# EasyEDA Pro project DevBoard_20240716.eprj

# Schematic Sheet2
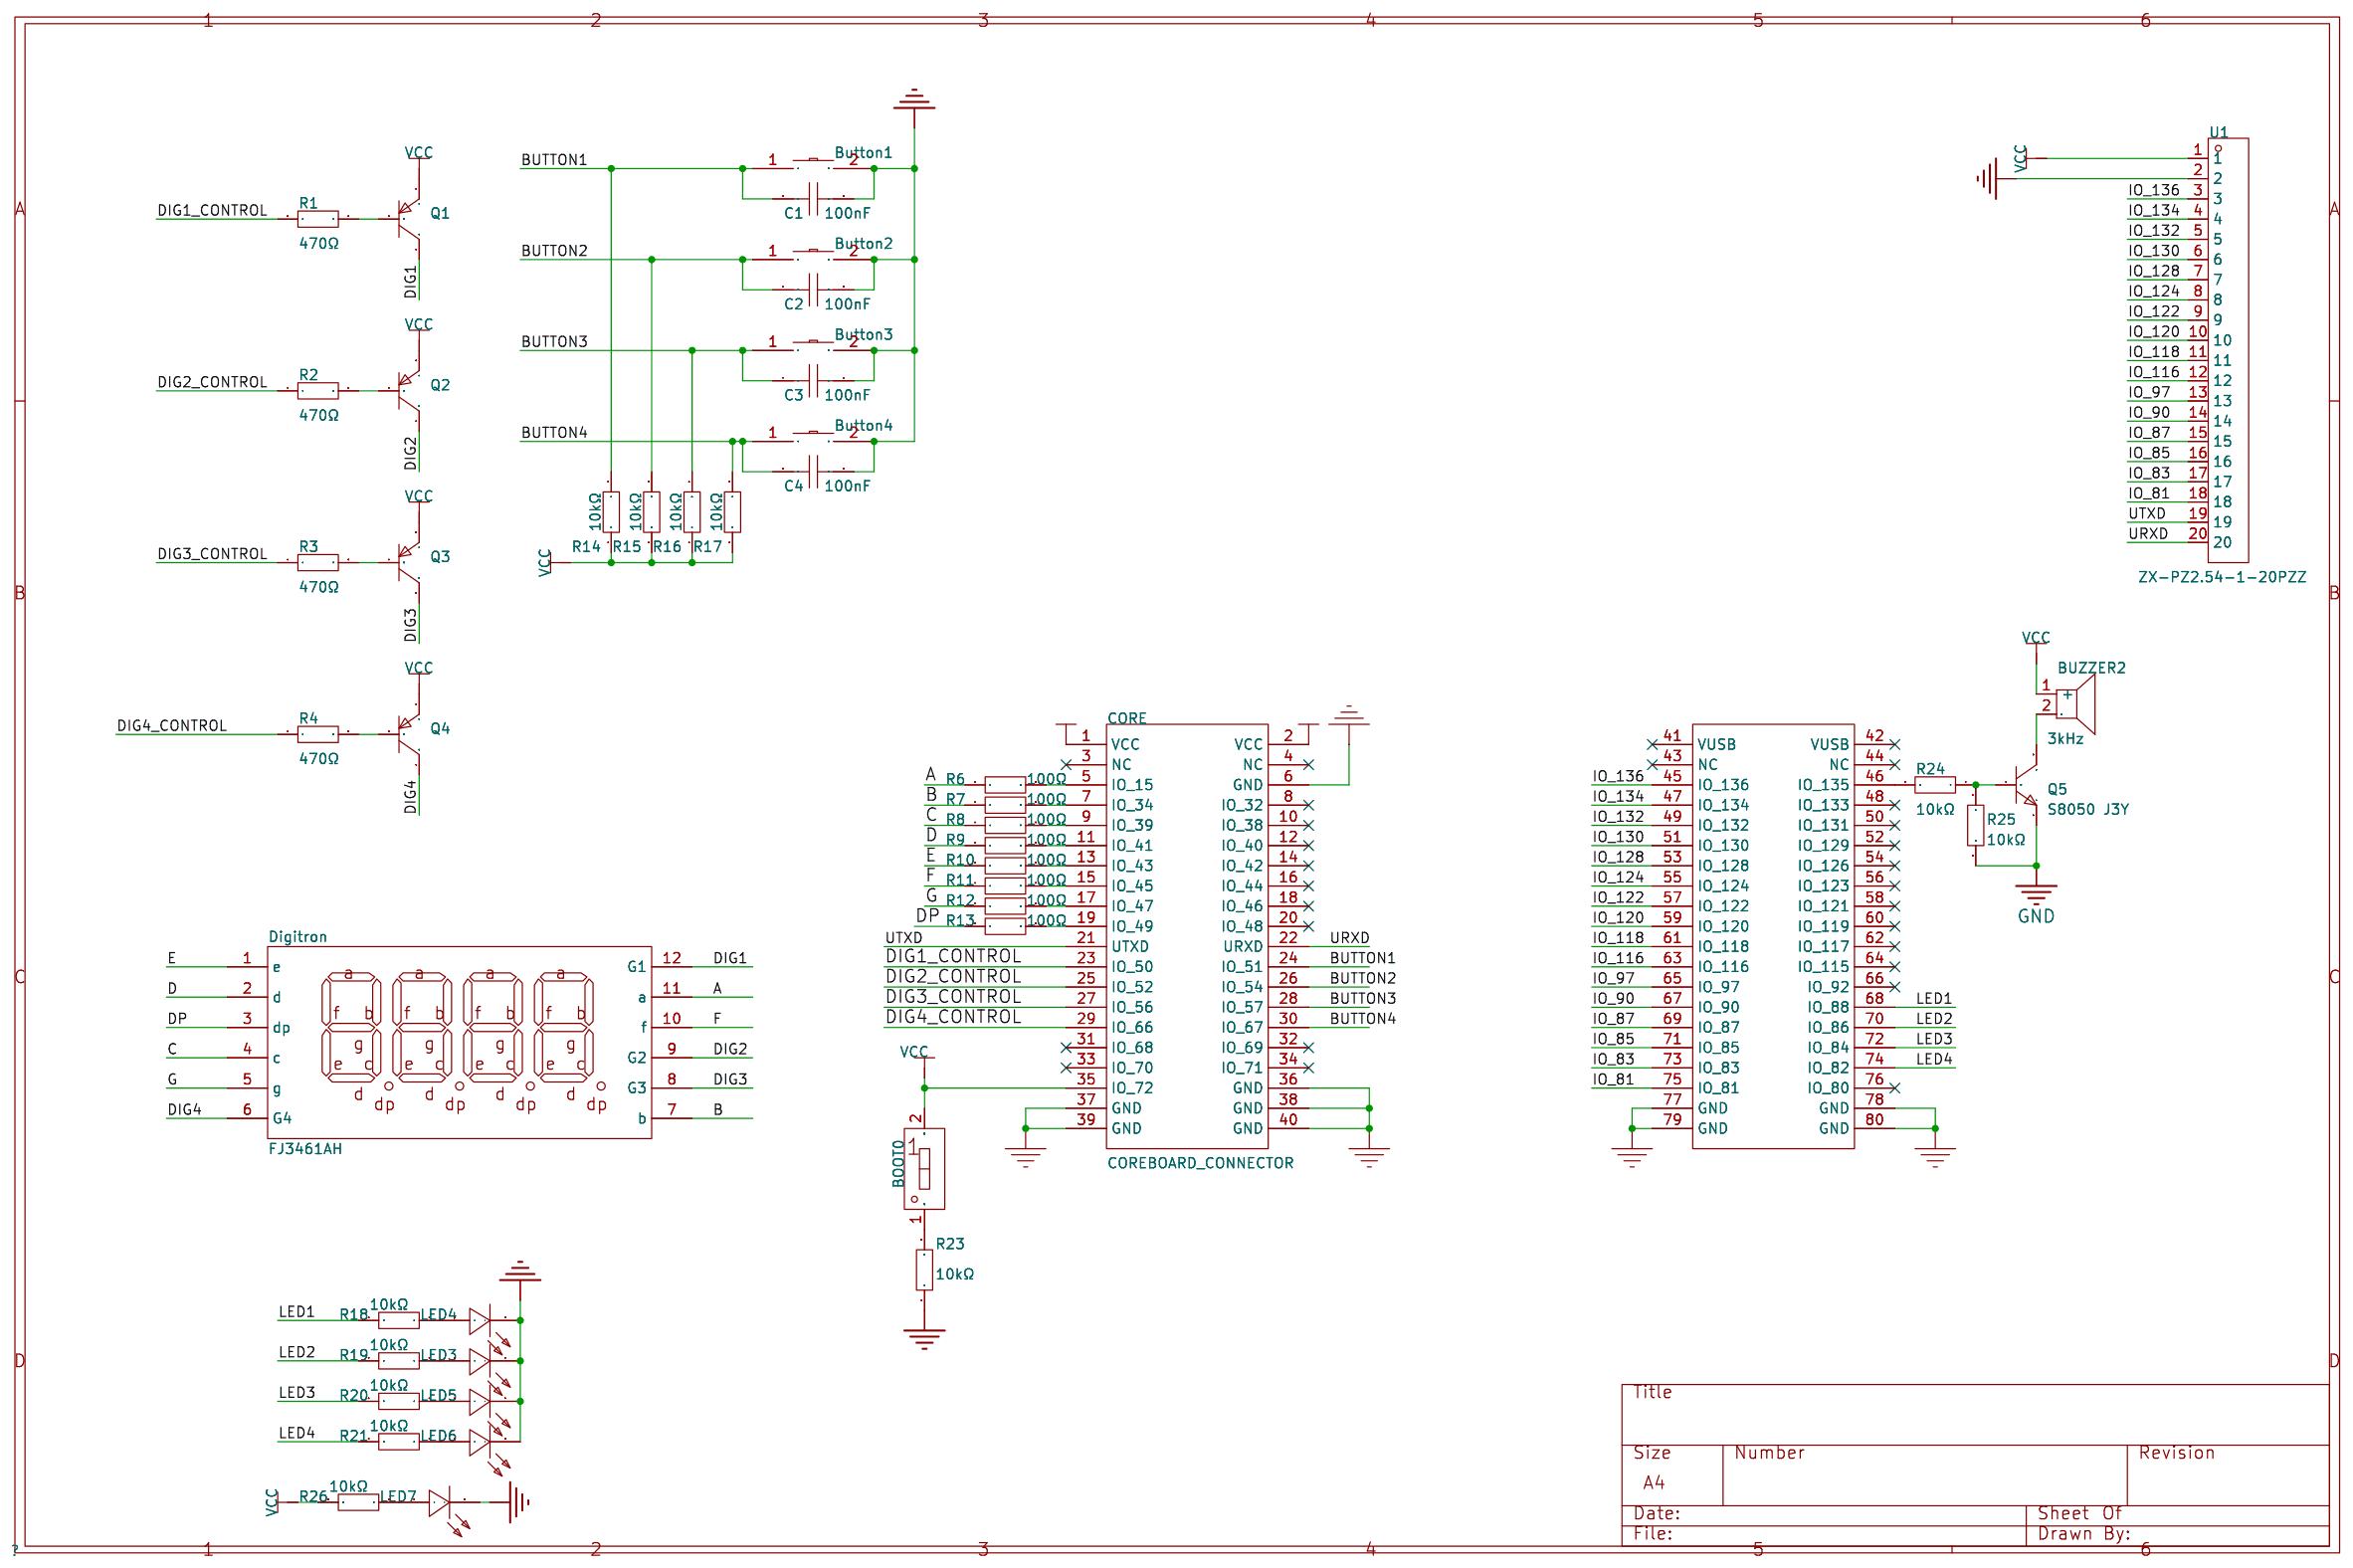
[diagram p0: schematic sheet]

## Parts
BOOT0  DSIC01LS-P  [SW-SMD_2P-L3.5-W6.2-P2.54-LS9.8]
Button1  TS-1101-C-W  [SW-SMD_L6.0-W3.3-LS8.0]
Button2  TS-1101-C-W  [SW-SMD_L6.0-W3.3-LS8.0]
Button3  TS-1101-C-W  [SW-SMD_L6.0-W3.3-LS8.0]
Button4  TS-1101-C-W  [SW-SMD_L6.0-W3.3-LS8.0]
BUZZER2  3kHz  [BUZ-TH_BD9.6-P5.00-D0.7-FD]
C1  100nF  [C0603]
C2  100nF  [C0603]
C3  100nF  [C0603]
C4  100nF  [C0603]
CORE  COREBOARD_CONNECTOR  [coreboard_connector]
Digitron  FJ3461AH  [LED-SEG-TH_12P-L30.0-W14.0-P2.54-S10.16-BL]
LED3  NCD0805B2  [LED0805-R-RD]
LED4  NCD0805B2  [LED0805-R-RD]
LED5  NCD0805B2  [LED0805-R-RD]
LED6  NCD0805B2  [LED0805-R-RD]
LED7  NCD0805B2  [LED0805-R-RD]
Q1  -  [S8550P_SOT]
Q2  -  [S8550P_SOT]
Q3  -  [S8550P_SOT]
Q4  -  [S8550P_SOT]
Q5  S8050 J3Y  [SOT-23-3_L3.0-W1.7-P0.95-LS2.9-BR]
R1  470Ω  [R0603]
R2  470Ω  [R0603]
R3  470Ω  [R0603]
R4  470Ω  [R0603]
R6  100Ω  [R0603]
R7  100Ω  [R0603]
R8  100Ω  [R0603]
R9  100Ω  [R0603]
R10  100Ω  [R0603]
R11  100Ω  [R0603]
R12  100Ω  [R0603]
R13  100Ω  [R0603]
R14  10kΩ  [R0603]
R15  10kΩ  [R0603]
R16  10kΩ  [R0603]
R17  10kΩ  [R0603]
R18  10kΩ  [R0603]
R19  10kΩ  [R0603]
R20  10kΩ  [R0603]
R21  10kΩ  [R0603]
R23  10kΩ  [R0603]
R24  10kΩ  [R0805]
R25  10kΩ  [R0805]
R26  10kΩ  [R0603]
U1  ZX-PZ2.54-1-20PZZ  [HDR-TH_20P-P2.54-V-M]

## Library data of the parts
BOOT0 = DSIC01LS-P: 类型:平拨,凸起式;电路结构:单刀单掷;开关位数:1位;额定电流:25mA;额定电压:24V;使用寿命:3千次;颜色:黑色;; LCSC Part Name: 平拨,凸起式 1位拨码开关; Supplier Part: C600988; Manufacturer: XKB Connectivity(中国星坤); Supplier Footprint: SMD,3.5x6.2mm; JLCPCB Part Class: 扩展库; Datasheet: https://atta.szlcsc.com/upload/public/pdf/source/20181029/C319044_89B44386426E378AA9595AB22F0589AA.pdf; Supplier: LCSC; Type: 平拨,凸起式; Circuit: 单刀单掷; Number of Positions: 1位; Pin Style: 鸥翼型; Current Rating: 25mA; Voltage Rating: 24V; Operating Temperature: -20℃~+70℃; Operating Life: 3千次; Color: 黑色
Button1-Button4 = TS-1101-C-W: 电路结构:单刀单掷;按钮形状:矩形按钮;作用力:260gf;安装方式:立贴;开关长度:6mm;开关宽度:3.6mm;开关高度:2.5mm;带支架:不带;触点电流:50mA;额定电压(AC):-;额定电压(DC):12V;额定功率:-;绝缘电阻:-;带灯:无;机械寿命:5万次;; LCSC Part Name: 6*3.6*2.5mm 立贴 轻触开关; Supplier Part: C318938; Manufacturer: XKB Connectivity(中国星坤); Supplier Footprint: SMD; JLCPCB Part Class: 扩展库; Datasheet: https://atta.szlcsc.com/upload/public/pdf/source/20200227/C318938_C2E53B1EEDE37D980A33616AC086DE53.pdf; Supplier: LCSC; Circuit: 单刀单掷; Actuator Style: 矩形按钮; Operating Force: 260gf; Mounting Style: 立贴; Switch Length: 6mm; Switch Width: 3.6mm; Switch Height: 2.5mm; Strike Gundam: 不带; Contact Current: 50mA; Voltage Rating (DC): 12V; Actuator/Cap Color: 白色带淡绿; With Lamp: 无; Mechanical Life: 5万次; Operating Temperature: -30℃~+85℃
BUZZER2 = HNB09A05: 驱动方式:有源(内含驱动线路);构造类型:电磁式;频率:3kHz;声压(SPL):85dB;; Supplier Part: C96493; Manufacturer: 华能; Supplier Footprint: 插件,D=9mm; JLCPCB Part Class: 扩展库; Datasheet: https://atta.szlcsc.com/upload/public/pdf/source/20170522/1495448327549.pdf; Supplier: LCSC; Oscillator Circuit: 有源(内含驱动线路); Technology Type: 电磁式; Operating Voltage: 4V~8V; Sound Pressure Level (SPL): 85dB; Diameter (φD): 9mm; Height: 5.7mm
C1-C4 = CC0603KRX7R9BB104: 容值:100nF;精度:±10%;额定电压:50V;材质(温度系数):X7R;; LCSC Part Name: 100nF ±10% 50V; Supplier Part: C14663; Manufacturer: YAGEO(国巨); Supplier Footprint: 0603; JLCPCB Part Class: 基础库; Datasheet: https://atta.szlcsc.com/upload/public/pdf/source/20180910/C282072_33301C7F631E79921B82A8DAC6BCC5B3.pdf; Supplier: LCSC; Tolerance: ±10%; Voltage Rated: 50V; Temperature Coefficient: X7R
CORE = COREBOARD_CONNECTOR: Library Name: 原理图库
Digitron = FJ3461AH: 数码管位数:4位;功耗:-;发光颜色:红色;LED极性:共阴极;数字/字母大小(英寸):0.36;; LCSC Part Name: 4位0.36英寸红色数码管 共阴极; Supplier Part: C10708; Manufacturer: 志浩; Supplier Footprint: 插件; JLCPCB Part Class: 扩展库; Datasheet: https://atta.szlcsc.com/upload/public/pdf/source/20121231/1457706574766.pdf; Supplier: LCSC; Number of Characters: 4位; Module Size: 30mmx14mmx7.2mm; Luminous Color: 红色; LED Polarity: 共阴极; Digit/Alpha Size(inch): 0.36
LED3-LED7 = NCD0805B2: 发光颜色:蓝色;正向电压(VF):2.5V~3.6V;功率:72mW;正向电流:2mA;主波长:468nm~478nm;透镜颜色:无色透明透镜;发光强度:20mcd~55mcd;发光角度:130°;工作温度:-30℃~+85℃;; Supplier Part: C84259; Manufacturer: 国星光电; Supplier Footprint: 0805; JLCPCB Part Class: 扩展库; Datasheet: https://atta.szlcsc.com/upload/public/pdf/source/20200820/C84259_E5AC6865415989C4C2C2831134BA3A23.pdf; Supplier: LCSC; Emitted Color: 蓝色; Forward Voltage (VF): 2.5V~3.6V; Power Dissipation: 72mW; Forward Current: 2mA; Dominant Wavelength: 468nm~478nm; Lens Color: 无色透明透镜; Luminous Intensity: 20mcd~55mcd; Viewing Angle: 130°; Operating Temperature: -30℃~+85℃
Q1-Q4 = S8550_SOT_PNP: Supplier Footprint: SOT-23
Q5 = S8050 J3Y_C2146: 晶体管类型:NPN;集射极击穿电压(Vceo):25V;集电极电流(Ic):500mA;功率(Pd):300mW;直流电流增益(hFE@Ic,Vce):200@50mA,1V;; LCSC Part Name: NPN 25V 500mA (200-350); Supplier Part: C2146; Manufacturer: CJ(江苏长电/长晶); Supplier Footprint: SOT-23; Datasheet: https://atta.szlcsc.com/upload/public/pdf/source/20140809/1457707209234.pdf; Supplier: LCSC; Transistor Type: NPN; Collector-Emitter Breakdown Voltage (Vceo): 25V; Collector Current (Ic): 500mA; Power Dissipation (Pd): 300mW; Collector Cut-Off Current (Icbo): 100nA; Collector-Emitter Saturation Voltage (VCE(sat)@Ic,Ib): 600mV@500mA,50mA; DC Current Gain (hFE@Ic,Vce): 200@50mA,1V; Transition Frequency (fT): 150MHz; Operating Temperature: +150℃@(Tj)
R1-R4 = 0603WAF4700T5E: 电阻类型:厚膜电阻;阻值:470Ω;精度:±1%;功率:100mW;最大工作电压:75V;温度系数:±100ppm/℃;; LCSC Part Name: 470Ω ±1% 100mW 厚膜电阻; Supplier Part: C23179; Manufacturer: UNI-ROYAL(厚声); Supplier Footprint: 0603; JLCPCB Part Class: 基础库; Datasheet: https://atta.szlcsc.com/upload/public/pdf/source/20200306/C422600_1E6D84923E4A46A82E41ADD87F860B5C.pdf; Supplier: LCSC; Type: 厚膜电阻; Tolerance: ±1%; Power(Watts): 100mW; Overload Voltage (Max): 75V; Temperature Coefficient: ±100ppm/℃; Operating Temperature Range: -55℃~+155℃
R6-R13 = 0603WAF1000T5E: 电阻类型:厚膜电阻;阻值:100Ω;精度:±1%;功率:100mW;最大工作电压:75V;温度系数:±200ppm/℃;; LCSC Part Name: 100Ω ±1% 100mW 厚膜电阻; Supplier Part: C22775; Manufacturer: UNI-ROYAL(厚声); Supplier Footprint: 0603; JLCPCB Part Class: 基础库; Datasheet: https://atta.szlcsc.com/upload/public/pdf/source/20200306/C422600_1E6D84923E4A46A82E41ADD87F860B5C.pdf; Supplier: LCSC; Type: 厚膜电阻; Tolerance: ±1%; Power(Watts): 100mW; Overload Voltage (Max): 75V; Temperature Coefficient: ±200ppm/℃; Operating Temperature Range: -55℃~+155℃
R14-R21 R23 R26 = 0603WAF1002T5E: 电阻类型:厚膜电阻;阻值:10kΩ;精度:±1%;功率:100mW;最大工作电压:75V;温度系数:±100ppm/℃;; LCSC Part Name: 厚膜电阻 10kΩ ±1% 100mW; Supplier Part: C25804; Manufacturer: UNI-ROYAL(厚声); Supplier Footprint: 0603; JLCPCB Part Class: 基础库; Datasheet: https://atta.szlcsc.com/upload/public/pdf/source/20200306/C422600_1E6D84923E4A46A82E41ADD87F860B5C.pdf; Supplier: LCSC; Type: 厚膜电阻; Tolerance: ±1%; Power(Watts): 100mW; Overload Voltage (Max): 75V; Temperature Coefficient: ±100ppm/℃; Operating Temperature Range: -55℃~+155℃
R24 R25 = 0805W8F1002T5E_C17414: 阻值:10kΩ;精度:±1%;功率:125mW;温度系数:±100ppm/℃;电阻类型:厚膜电阻;; LCSC Part Name: 10kΩ ±1% 125mW 厚膜电阻; Supplier Part: C17414; Manufacturer: UNI-ROYAL(厚声); Manufacturer Part: 0805W8F1002T5E; Supplier Footprint: 0805; Datasheet: https://atta.szlcsc.com/upload/public/pdf/source/20200306/C422600_1E6D84923E4A46A82E41ADD87F860B5C.pdf; Supplier: LCSC; Tolerance: ±1%; Power(Watts): 125mW; Overload Voltage (Max): 150V; Temperature Coefficient: ±100ppm/℃; Type: 厚膜电阻; Operating Temperature Range: -55℃~+155℃
U1 = ZX-PZ2.54-1-20PZZ: 插针结构:1x20P;间距:2.54mm;行距:-;圆针/方针:方针;安装类型:直插;排数:单排;总PIN位数:20P;额定电流:3A;额定电压:1kV;配合针长度:6mm;塑高:2.5mm;端接针长度:3mm;触头材质:黄铜;触头镀层:金;工作温度范围:-40℃~+105℃;焊接温度(最大值):-;颜色:黑色;; LCSC Part Name: 1x20P 间距:2.54mm 方针 直插; Supplier Part: C7501271; Manufacturer: Megastar(兆星); Supplier Footprint: 插件,P=2.54mm; JLCPCB Part Class: 扩展库; Datasheet: https://atta.szlcsc.com/upload/public/pdf/source/20231122/B067D1B32B7C78CBB999092E986F6F61.pdf; Supplier: LCSC; Pin Structure: 1x20P; Pitch: 2.54mm; Circluar Pins/Square Pins: 方针; Mounting Type: 直插; Number of Rows: 单排; Number of Pins: 20P; Current Rating (Max): 3A; Voltage Rating (Max): 1kV; Length of Mating Pin: 6mm; Insulation Height: 2.5mm; Length of End Connection Pin: 3mm; Contact Material: 黄铜; Contact Plating: 金; Operating Temperature Range: -40℃~+105℃; Color: 黑色

## Nets
GND: Button1.2 Button2.2 Button3.2 Button4.2 C1.2 C2.2 C3.2 C4.2 CORE.6(GND) CORE.36(GND) CORE.37(GND) CORE.38(GND) CORE.39(GND) CORE.40(GND) CORE.77(GND) CORE.78(GND) CORE.79(GND) CORE.80(GND) LED3.2(-) LED4.2(-) LED5.2(-) LED6.2(-) LED7.2(-) Q5.2(E) R23.1 R25.2 U1.2
VCC: BOOT0.2(PIN2) BUZZER2.1(+) CORE.1(VCC) CORE.2(VCC) CORE.35(IO_72) Q1.2(E) Q2.2(E) Q3.2(E) Q4.2(E) R14.1 R15.1 R16.1 R17.1 R26.2 U1.1
A: Digitron.11(a) R6.1
B: Digitron.7(b) R7.1
BUTTON1: Button1.1 C1.1 CORE.24(IO_51) R14.2
BUTTON2: Button2.1 C2.1 CORE.26(IO_54) R15.2
BUTTON3: Button3.1 C3.1 CORE.28(IO_57) R16.2
BUTTON4: Button4.1 C4.1 CORE.30(IO_67) R17.2
C: Digitron.4(c) R8.1
D: Digitron.2(d) R9.1
DIG1: Digitron.12(G1) Q1.3(C)
DIG1_CONTROL: CORE.23(IO_50) R1.2
DIG2: Digitron.9(G2) Q2.3(C)
DIG2_CONTROL: CORE.25(IO_52) R2.1
DIG3: Digitron.8(G3) Q3.3(C)
DIG3_CONTROL: CORE.27(IO_56) R3.1
DIG4: Digitron.6(G4) Q4.3(C)
DIG4_CONTROL: CORE.29(IO_66) R4.1
DP: Digitron.3(dp) R13.1
E: Digitron.1(e) R10.1
F: Digitron.10(f) R11.1
G: Digitron.5(g) R12.1
IO_81: CORE.75(IO_81) U1.18
IO_83: CORE.73(IO_83) U1.17
IO_85: CORE.71(IO_85) U1.16
IO_87: CORE.69(IO_87) U1.15
IO_90: CORE.67(IO_90) U1.14
IO_97: CORE.65(IO_97) U1.13
IO_116: CORE.63(IO_116) U1.12
IO_118: CORE.61(IO_118) U1.11
IO_120: CORE.59(IO_120) U1.10
IO_122: CORE.57(IO_122) U1.9
IO_124: CORE.55(IO_124) U1.8
IO_128: CORE.53(IO_128) U1.7
IO_130: CORE.51(IO_130) U1.6
IO_132: CORE.49(IO_132) U1.5
IO_134: CORE.47(IO_134) U1.4
IO_136: CORE.45(IO_136) U1.3
LED1: CORE.68(IO_88) R18.2
LED2: CORE.70(IO_86) R19.2
LED3: CORE.72(IO_84) R20.2
LED4: CORE.74(IO_82) R21.2
URXD: CORE.22(URXD) U1.20
UTXD: CORE.21(UTXD) U1.19
$1N2952: Q1.1(B) R1.1
$1N2997: Q2.1(B) R2.2
$1N3042: Q3.1(B) R3.2
$1N3087: Q4.1(B) R4.2
$1N3645: CORE.5(IO_15) R6.2
$1N3690: CORE.7(IO_34) R7.2
$1N3862: CORE.9(IO_39) R8.2
$1N3907: CORE.11(IO_41) R9.2
$1N3952: CORE.13(IO_43) R10.2
$1N3997: CORE.15(IO_45) R11.2
$1N4042: CORE.17(IO_47) R12.2
$1N4087: CORE.19(IO_49) R13.2
$1N6621: Q5.1(B) R24.1 R25.1
$1N6767: CORE.46(IO_135) R24.2
Net-(BOOT0-1): BOOT0.1(PIN1) R23.2
Net-(BUZZER2-2): BUZZER2.2 Q5.3(C)
Net-(LED3-1): LED3.1(+) R19.1
Net-(LED4-1): LED4.1(+) R18.1
Net-(LED5-1): LED5.1(+) R20.1
Net-(LED6-1): LED6.1(+) R21.1
Net-(LED7-1): LED7.1(+) R26.1

Not connected (* = marked no-connect by the designer): CORE 3(NC)* 4(NC)* 8(IO_32)* 10(IO_38)* 12(IO_40)* 14(IO_42)* 16(IO_44)* 18(IO_46)* 20(IO_48)* 31(IO_68)* 32(IO_69)* 33(IO_70)* 34(IO_71)* 41(VUSB)* 42(VUSB)* 43(NC)* 44(NC)* 48(IO_133)* 50(IO_131)* 52(IO_129)* 54(IO_126)* 56(IO_123)* 58(IO_121)* 60(IO_119)* 62(IO_117)* 64(IO_115)* 66(IO_92)* 76(IO_80)*

# Board PCB2
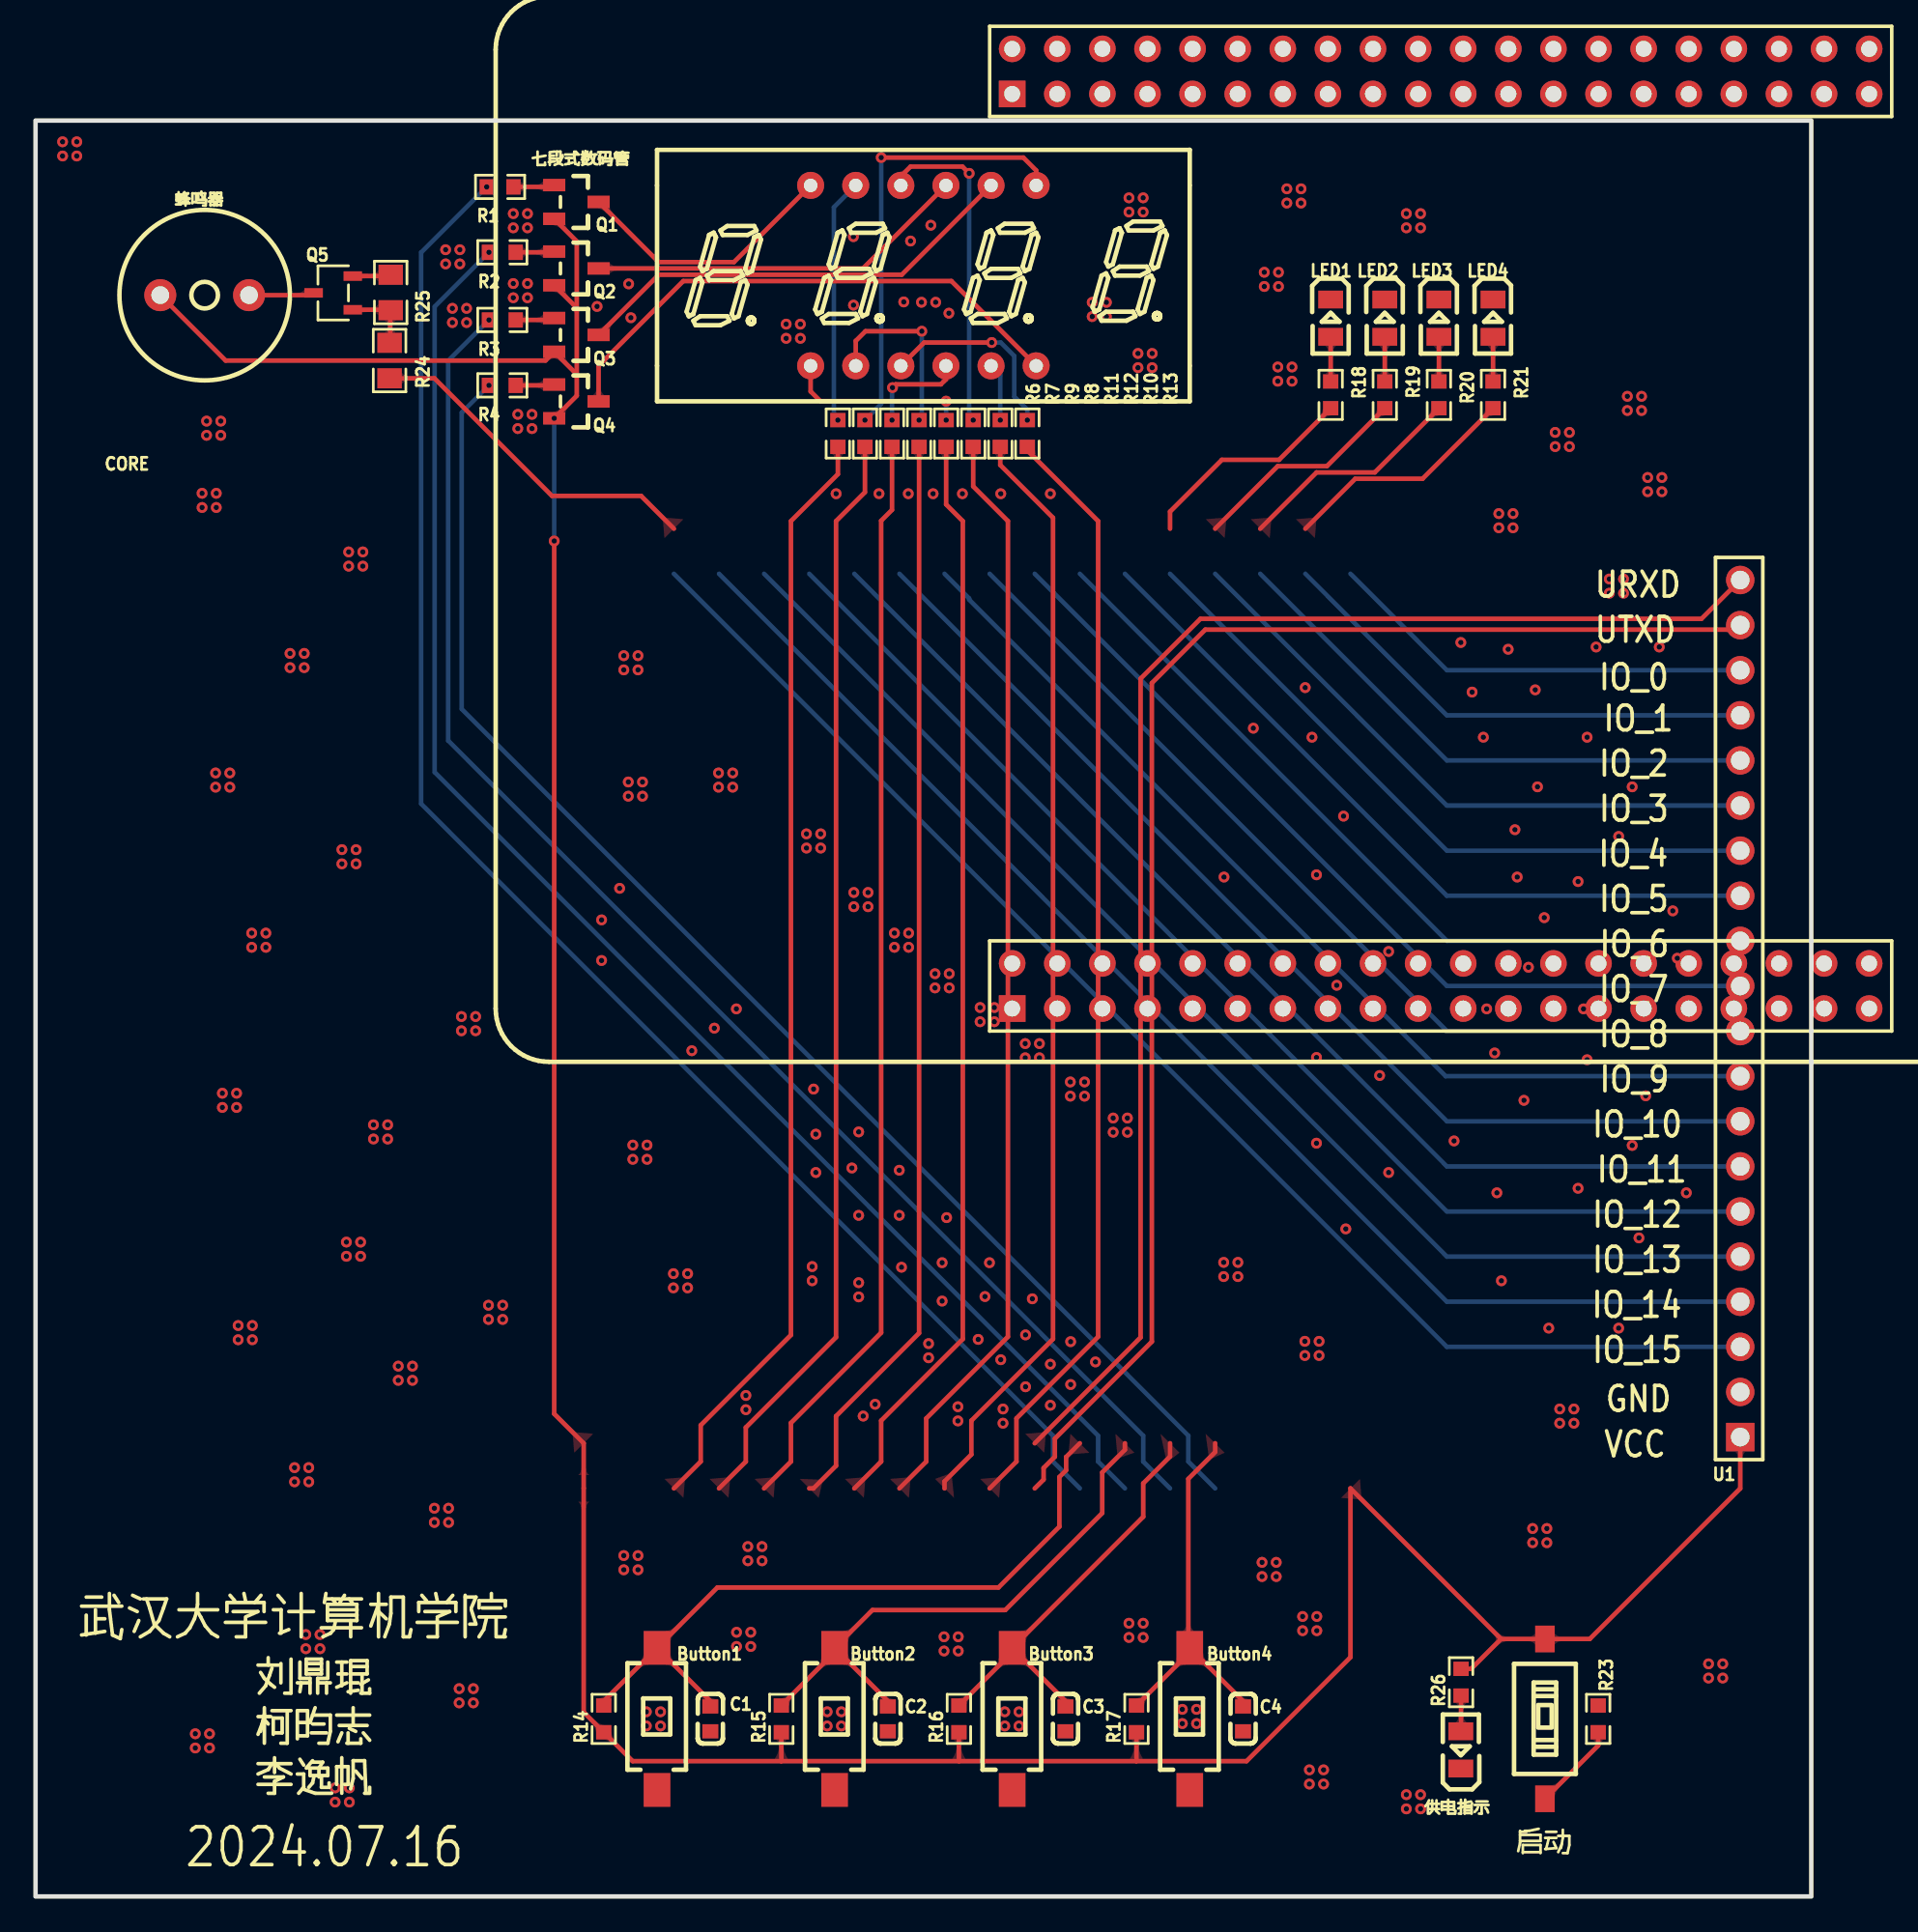
[diagram p1: board, top side]
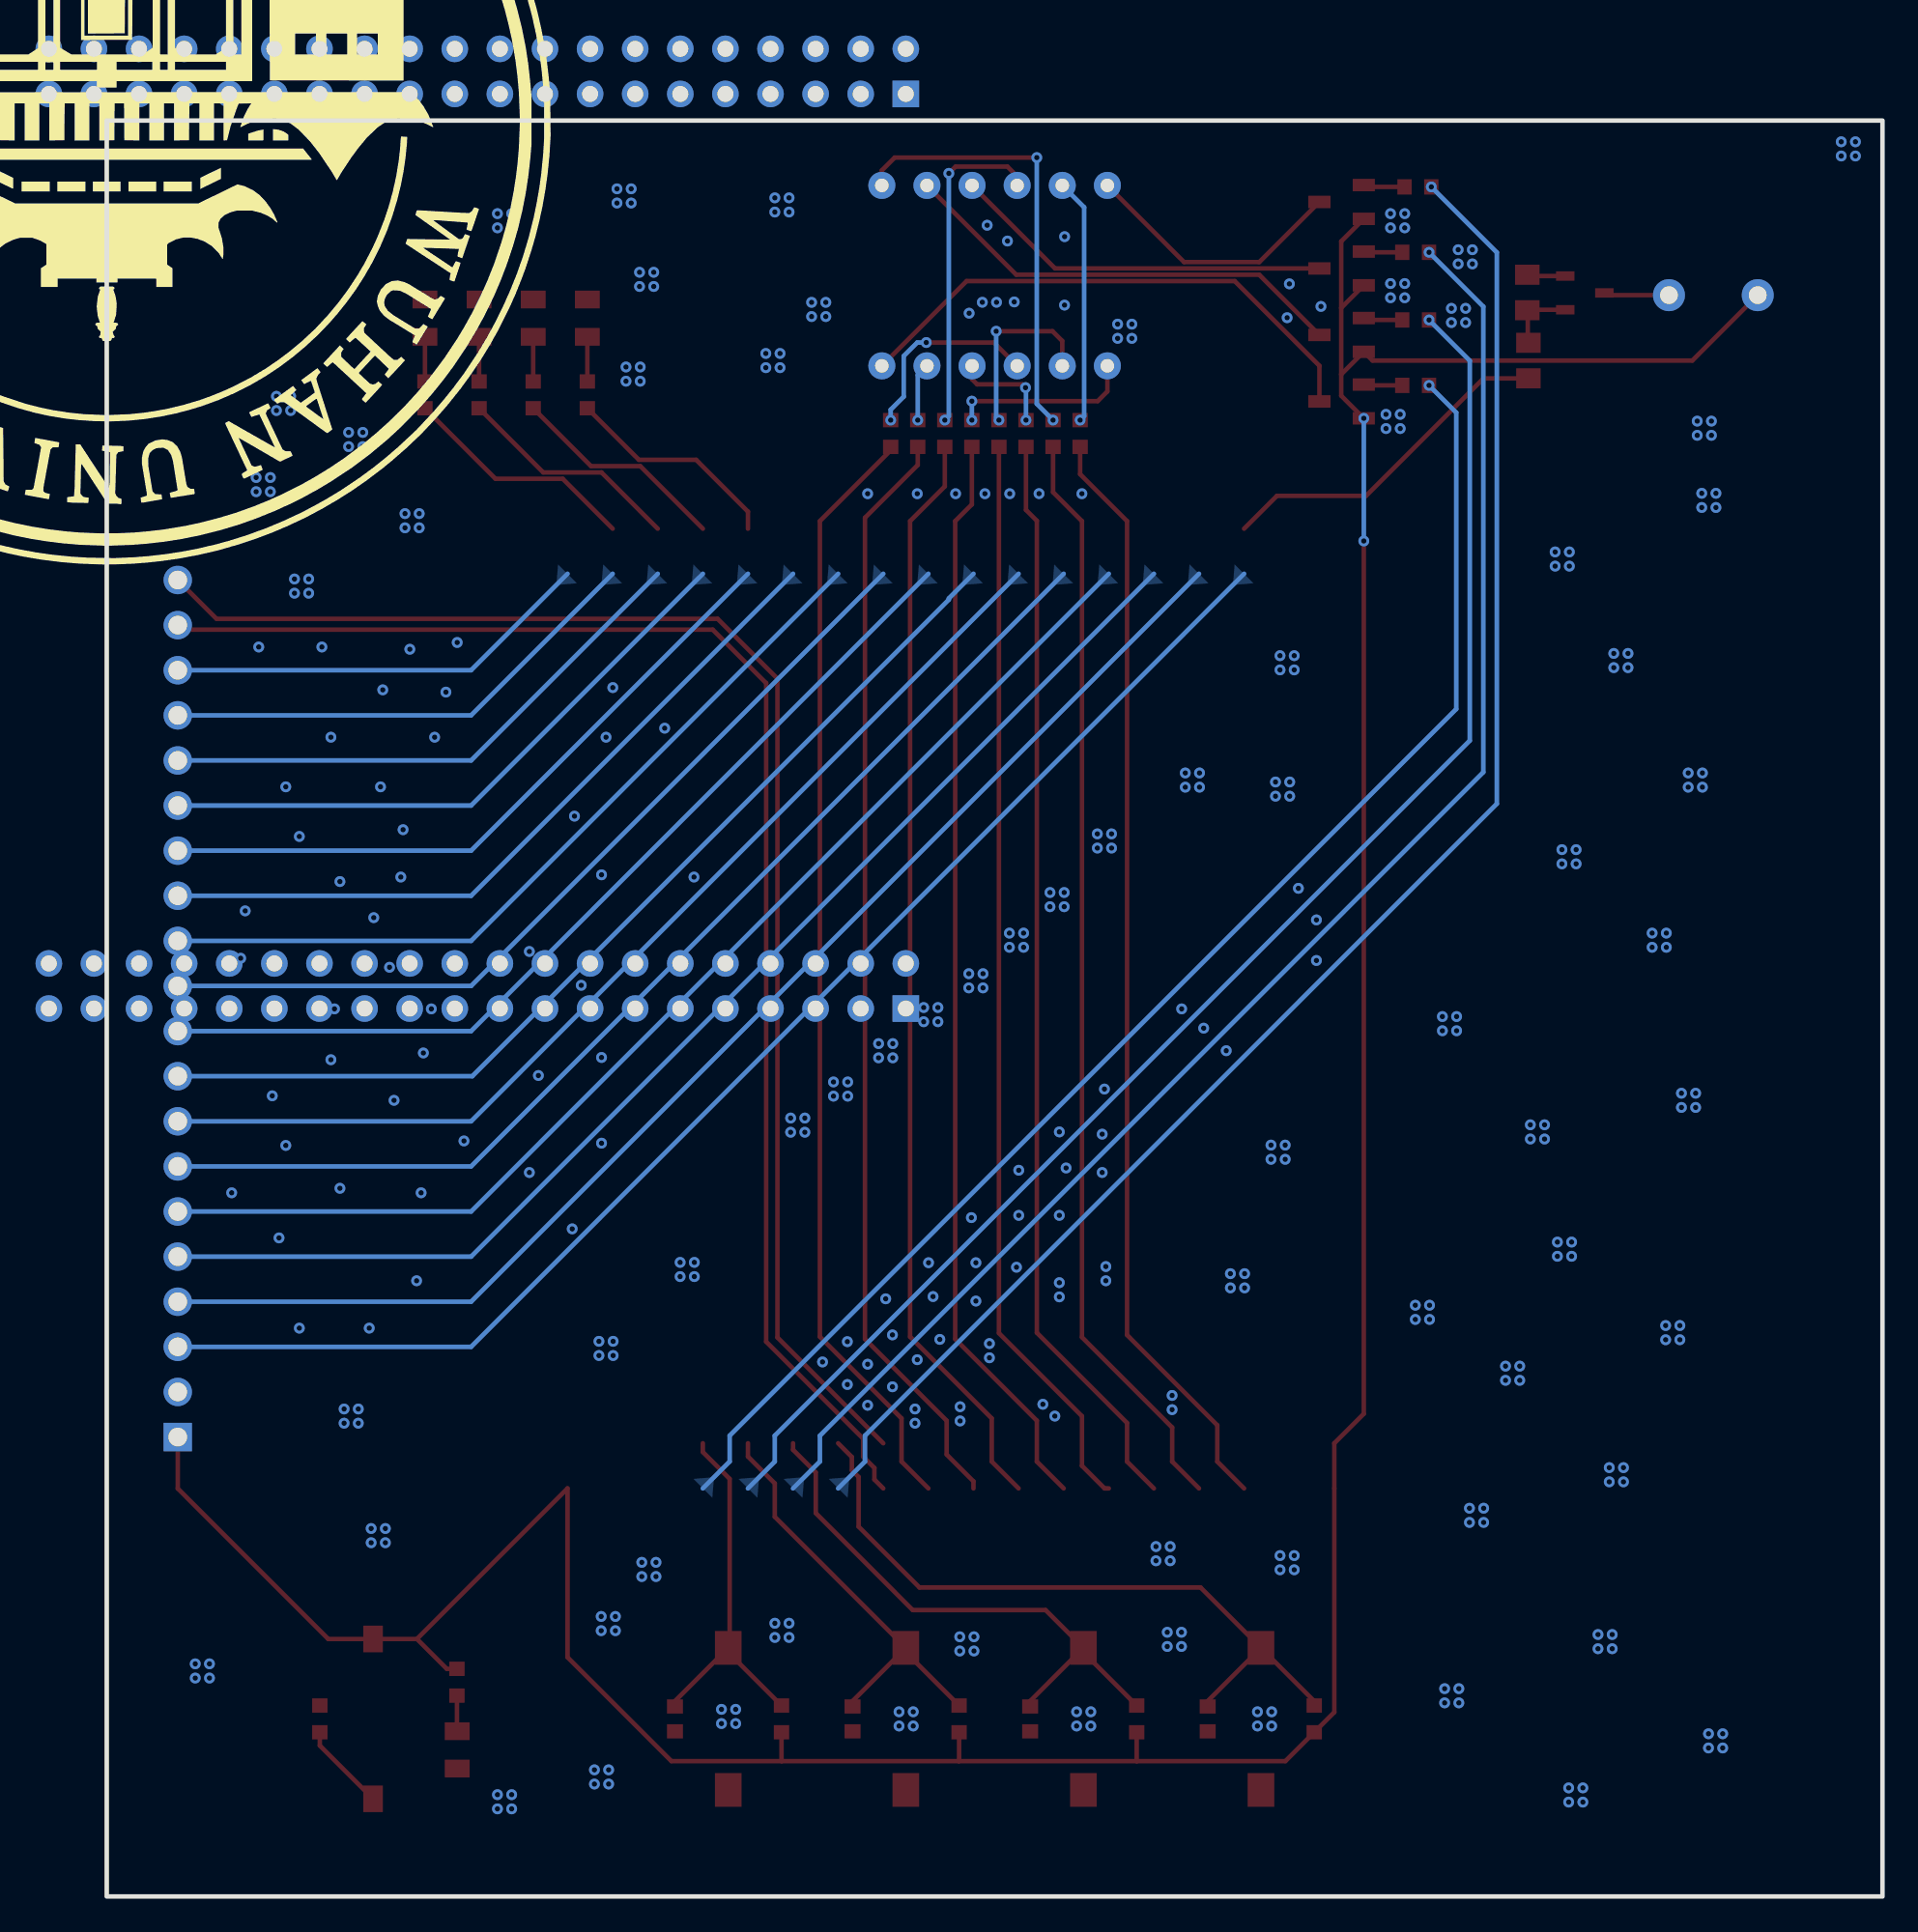
[diagram p2: board, bottom side, seen from below]

Outline 100 x 100 mm; copper layers: Top Layer, Bottom Layer. Coordinates in mm from the lower left corner of the outline.
Outline path: rectangle 0,100 100,0
Stack: Top Layer 0.035mm / Dielectric1 1.51mm FR4 er 4.5 / Bottom Layer 0.035mm

## Design rules (mm)
template: 自定义配置
spacing copperThickness1oz (default): track to track 0.102, other pairs 0.152 to 0.3
spacing copperThickness2oz: track to track 0.203, other pairs 0.152 to 0.3
track width copperThickness1oz (default): min 0.254, default 0.305, max 2.54
track width copperThickness2oz: min 0.203, default 0.254, max 2.54
differential pair differentialPair (default): width min 0.127, default 0.254, max 2.54; gap min 0.152, default 0.152
via viaSize (default): diameter min 0.5, default 0.61, max 10; hole min 0.3, default 0.305, max 6.299

## Placement (name value [footprint] x y rotation side)
Button1  TS-1101-C-W  [SW-SMD_L6.0-W3.3-LS8.0]  35 10 270 top
Button2  TS-1101-C-W  [SW-SMD_L6.0-W3.3-LS8.0]  45 10 270 top
Button3  TS-1101-C-W  [SW-SMD_L6.0-W3.3-LS8.0]  55 10 270 top
Button4  TS-1101-C-W  [SW-SMD_L6.0-W3.3-LS8.0]  65 10 270 top
C1  100nF  [C0603]  38 10 270 top
C2  100nF  [C0603]  48 10 270 top
C3  100nF  [C0603]  58 10 270 top
C4  100nF  [C0603]  68 10 270 top
CORE  COREBOARD_CONNECTOR  [coreboard_connector]  55 50 0 top
LED1  NCD0805B2  [LED0805-R-RD]  72.94 88.87 270 top
LED2  NCD0805B2  [LED0805-R-RD]  75.98 88.87 270 top
LED3  NCD0805B2  [LED0805-R-RD]  79.03 88.87 270 top
LED4  NCD0805B2  [LED0805-R-RD]  82.08 88.87 270 top
Q1  -  [S8550P_SOT]  30.5 95.42 180 top
Q2  -  [S8550P_SOT]  30.5 91.67 180 top
Q3  -  [S8550P_SOT]  30.5 87.93 180 top
Q4  -  [S8550P_SOT]  30.5 84.19 180 top
Q5  S8050 J3Y  [SOT-23-3_L3.0-W1.7-P0.95-LS2.9-BR]  16.76 90.3 0 top
R1  470Ω  [R0603]  26.16 96.27 180 top
R2  470Ω  [R0603]  26.29 92.58 0 top
R3  470Ω  [R0603]  26.29 88.77 0 top
R4  470Ω  [R0603]  26.29 85.09 0 top
R6  100Ω  [R0603]  45.18 82.38 270 top
R7  100Ω  [R0603]  46.71 82.38 270 top
R8  100Ω  [R0603]  48.23 82.38 270 top
R9  100Ω  [R0603]  49.76 82.38 270 top
R10  100Ω  [R0603]  51.28 82.38 270 top
R11  100Ω  [R0603]  52.8 82.38 270 top
R12  100Ω  [R0603]  54.33 82.38 270 top
R13  100Ω  [R0603]  55.85 82.38 270 top
R14  10kΩ  [R0603]  32 10 90 top
R15  10kΩ  [R0603]  42 10 90 top
R16  10kΩ  [R0603]  52 10 90 top
R17  10kΩ  [R0603]  62 10 90 top
R18  10kΩ  [R0603]  72.94 84.56 270 top
R19  10kΩ  [R0603]  75.98 84.56 270 top
R20  10kΩ  [R0603]  79.03 84.56 270 top
R21  10kΩ  [R0603]  82.08 84.56 270 top
R23  10kΩ  [R0603]  88 10 270 top
R24  10kΩ  [R0805]  19.94 86.49 270 top
R25  10kΩ  [R0805]  20 90.32 90 top
R26  10kΩ  [R0603]  80.28 12.06 90 top
U1  ZX-PZ2.54-1-20PZZ  [HDR-TH_20P-P2.54-V-M]  96 50 90 top
七段式数码管  FJ3461AH  [LED-SEG-TH_12P-L30.0-W14.0-P2.54-S10.16-BL]  50 91.27 0 top
供电指示  NCD0805B2  [LED0805-R-RD]  80.26 8.25 90 top
启动  DSIC01LS-P  [SW-SMD_2P-L3.5-W6.2-P2.54-LS9.8]  85 10 90 top
蜂鸣器  3kHz  [BUZ-TH_BD9.6-P5.00-D0.7-FD]  9.53 90.17 0 top

## Footprints (pads in the part's own frame, mm; a bottom-side part is the same pattern mirrored in y, then rotated)
BUZ-TH_BD9.6-P5.00-D0.7-FD
  round 1.8 hole 1: 1(-2.5,0) 2(2.5,0)
C0603
  rect 0.8x0.9 smd: 1(-0.7,0) 2(0.7,0)
coreboard_connector
  rect 1.5x1.5 hole 0.9: 1(0,0) 41(0,51.5)
  round 1.5 hole 0.9: 2(0,2.54) 3(2.54,0) 4(2.54,2.54) 5(5.08,0) 6(5.08,2.54) 7(7.62,0) 8(7.62,2.54) 9(10.16,0) 10(10.16,2.54) 11(12.7,0) 12(12.7,2.54) 13(15.24,0) 14(15.24,2.54) 15(17.78,0) 16(17.78,2.54) 17(20.32,0) 18(20.32,2.54) 19(22.86,0) 20(22.86,2.54) 21(25.4,0) 22(25.4,2.54) 23(27.94,0) 24(27.94,2.54) 25(30.48,0) 26(30.48,2.54) 27(33.02,0) 28(33.02,2.54) 29(35.56,0) 30(35.56,2.54) 31(38.1,0) 32(38.1,2.54) 33(40.64,0) 34(40.64,2.54) 35(43.18,0) 36(43.18,2.54) 37(45.72,0) 38(45.72,2.54) 39(48.26,0) 40(48.26,2.54) 42(0,54.04) 43(2.54,51.5) 44(2.54,54.04) 45(5.08,51.5) 46(5.08,54.04) 47(7.62,51.5) 48(7.62,54.04) 49(10.16,51.5) 50(10.16,54.04) 51(12.7,51.5) 52(12.7,54.04) 53(15.24,51.5) 54(15.24,54.04) 55(17.78,51.5) 56(17.78,54.04) 57(20.32,51.5) 58(20.32,54.04) 59(22.86,51.5) 60(22.86,54.04) 61(25.4,51.5) 62(25.4,54.04) 63(27.94,51.5) 64(27.94,54.04) 65(30.48,51.5) 66(30.48,54.04) 67(33.02,51.5) 68(33.02,54.04) 69(35.56,51.5) 70(35.56,54.04) 71(38.1,51.5) 72(38.1,54.04) 73(40.64,51.5) 74(40.64,54.04) 75(43.18,51.5) 76(43.18,54.04) 77(45.72,51.5) 78(45.72,54.04) 79(48.26,51.5) 80(48.26,54.04)
HDR-TH_20P-P2.54-V-M
  rect 1.6x1.6 hole 1.05: 1(-24.13,0)
  round 1.6 hole 1.05: 2(-21.59,0) 3(-19.05,0) 4(-16.51,0) 5(-13.97,0) 6(-11.43,0) 7(-8.89,0) 8(-6.35,0) 9(-3.81,0) 10(-1.27,0) 11(1.27,0) 12(3.81,0) 13(6.35,0) 14(8.89,0) 15(11.43,0) 16(13.97,0) 17(16.51,0) 18(19.05,0) 19(21.59,0) 20(24.13,0)
LED0805-R-RD
  rect 1x1.399 smd: 1(1.05,0) 2(-1.05,0)
LED-SEG-TH_12P-L30.0-W14.0-P2.54-S10.16-BL
  round 1.524 hole 0.762: 1(-6.35,-5.08) 2(-3.81,-5.08) 3(-1.27,-5.08) 4(1.27,-5.08) 5(3.81,-5.08) 6(6.35,-5.08) 7(6.35,5.08) 8(3.81,5.08) 9(1.27,5.08) 10(-1.27,5.08) 11(-3.81,5.08) 12(-6.35,5.08)
R0603
  rect 0.806x0.864 smd: 1(-0.753,0) 2(0.753,0)
R0805
  rect 1.133x1.377 smd: 1(-1,0) 2(1,0)
S8550P_SOT
  rect 1.25x0.701 smd: 1(1.292,-0.95) 2(1.292,0.95) 3(-1.208,0)
SOT-23-3_L3.0-W1.7-P0.95-LS2.9-BR
  rect 1.038x0.532 smd: 1(1.101,-0.95) 2(1.101,0.95) 3(-1.101,0)
SW-SMD_2P-L3.5-W6.2-P2.54-LS9.8
  rect 1.5x1.1 smd: 1(-4.5,0) 2(4.5,0)
SW-SMD_L6.0-W3.3-LS8.0
  rect 1.9x1.5 smd: 1(-4,0) 2(4,0)

## Nets
GND: Button1.2 Button2.2 Button3.2 Button4.2 C1.2 C2.2 C3.2 C4.2 CORE.6 CORE.36 CORE.37 CORE.38 CORE.39 CORE.40 CORE.77 CORE.78 CORE.79 CORE.80 LED1.2 LED2.2 LED3.2 LED4.2 Q5.2 R23.1 R25.2 U1.2 供电指示.2
VCC: CORE.1 CORE.2 CORE.35 Q1.2 Q2.2 Q3.2 Q4.2 R14.1 R15.1 R16.1 R17.1 R26.2 U1.1 启动.2 蜂鸣器.1
A: R6.1 七段式数码管.11
B: R7.1 七段式数码管.7
BUTTON1: Button1.1 C1.1 CORE.24 R14.2
BUTTON2: Button2.1 C2.1 CORE.26 R15.2
BUTTON3: Button3.1 C3.1 CORE.28 R16.2
BUTTON4: Button4.1 C4.1 CORE.30 R17.2
C: R8.1 七段式数码管.4
D: R9.1 七段式数码管.2
DIG1: Q1.3 七段式数码管.12
DIG1_CONTROL: CORE.23 R1.2
DIG2: Q2.3 七段式数码管.9
DIG2_CONTROL: CORE.25 R2.1
DIG3: Q3.3 七段式数码管.8
DIG3_CONTROL: CORE.27 R3.1
DIG4: Q4.3 七段式数码管.6
DIG4_CONTROL: CORE.29 R4.1
DP: R13.1 七段式数码管.3
E: R10.1 七段式数码管.1
F: R11.1 七段式数码管.10
G: R12.1 七段式数码管.5
IO_81: CORE.75 U1.18
IO_83: CORE.73 U1.17
IO_85: CORE.71 U1.16
IO_87: CORE.69 U1.15
IO_90: CORE.67 U1.14
IO_97: CORE.65 U1.13
IO_116: CORE.63 U1.12
IO_118: CORE.61 U1.11
IO_120: CORE.59 U1.10
IO_122: CORE.57 U1.9
IO_124: CORE.55 U1.8
IO_128: CORE.53 U1.7
IO_130: CORE.51 U1.6
IO_132: CORE.49 U1.5
IO_134: CORE.47 U1.4
IO_136: CORE.45 U1.3
LED1: CORE.68 R18.2
LED2: CORE.70 R19.2
LED3: CORE.72 R20.2
LED4: CORE.74 R21.2
URXD: CORE.22 U1.20
UTXD: CORE.21 U1.19
$1N2952: Q1.1 R1.1
$1N2997: Q2.1 R2.2
$1N3042: Q3.1 R3.2
$1N3087: Q4.1 R4.2
$1N3645: CORE.5 R6.2
$1N3690: CORE.7 R7.2
$1N3862: CORE.9 R8.2
$1N3907: CORE.11 R9.2
$1N3952: CORE.13 R10.2
$1N3997: CORE.15 R11.2
$1N4042: CORE.17 R12.2
$1N4087: CORE.19 R13.2
$1N5868: LED1.1 R18.1
$1N5907: LED2.1 R19.1
$1N5946: LED3.1 R20.1
$1N5985: LED4.1 R21.1
$1N6404: R23.2 启动.1
$1N6621: Q5.1 R24.1 R25.1
$1N6622: Q5.3 蜂鸣器.2
$1N6767: CORE.46 R24.2
$1N7687: R26.1 供电指示.1

Pads without a net: CORE 3 4 8 10 12 14 16 18 20 31 32 33 34 41 42 43 44 48 50 52 54 56 58 60 62 64 66 76

## Via types
v1: diameter 0.61, hole 0.305, Top Layer to Bottom Layer, 409 vias

## Routing (per net, layer and track width the routed paths; a pad name or vN(x,y) marks a point on that pad's centre or on a via; arc(x,y) is an arc through that point)
GND: length 2.2
  Top Layer w0.254: R25.2 19.93,91.25 Q5.2
  vias: v1(1.52,98.81) v1(1.52,98.01) v1(2.32,98.81) v1(2.32,98.01) v1(9,9.16) v1(9,8.36) v1(9.38,79.01) v1(9.38,78.21) v1(9.63,83.08) v1(9.63,82.28) v1(9.8,9.16) v1(9.8,8.36) v1(10.14,63.27) v1(10.14,62.47) v1(10.18,79.01) v1(10.18,78.21) v1(10.43,83.08) v1(10.43,82.28) v1(10.52,45.23) v1(10.52,44.43) v1(10.94,63.27) v1(10.94,62.47) v1(11.32,45.23) v1(11.32,44.43) v1(11.41,32.15) v1(11.41,31.35) v1(12.17,54.25) v1(12.17,53.45) v1(12.21,32.15) v1(12.21,31.35) v1(12.97,54.25) v1(12.97,53.45) v1(14.33,70) v1(14.33,69.2) v1(14.59,24.15) v1(14.59,23.35) v1(15.13,70) v1(15.13,69.2) v1(15.22,14.75) v1(15.22,13.95) v1(15.39,24.15) v1(15.39,23.35) v1(16.02,14.75) v1(16.02,13.95) v1(16.87,6.12) v1(16.87,5.31) v1(17.25,58.95) v1(17.25,58.15) v1(17.51,36.85) v1(17.51,36.05) v1(17.63,75.71) v1(17.63,74.91) v1(17.67,6.12) v1(17.67,5.31) v1(18.05,58.95) v1(18.05,58.15) v1(18.31,36.85) v1(18.31,36.05) v1(18.43,75.71) v1(18.43,74.91) v1(19.03,43.45) v1(19.03,42.65) v1(19.83,43.45) v1(19.83,42.65) v1(20.43,29.86) v1(20.43,29.06) v1(21.23,29.86) v1(21.23,29.06) v1(22.46,21.86) v1(22.46,21.06) v1(23.09,92.73) v1(23.09,91.93) v1(23.26,21.86) v1(23.26,21.06) v1(23.48,89.43) v1(23.48,88.63) v1(23.89,92.73) v1(23.89,91.93) v1(23.86,11.7) v1(23.86,10.9) v1(23.98,49.55) v1(23.98,48.75) v1(24.28,89.43) v1(24.28,88.63) v1(24.66,11.7) v1(24.66,10.9) v1(24.78,49.55) v1(24.78,48.75) v1(25.51,33.29) v1(25.51,32.49) v1(26.31,33.29) v1(26.31,32.49) v1(26.91,94.76) v1(26.91,93.96) v1(26.91,90.82) v1(26.91,90.02) v1(27.16,83.46) v1(27.16,82.66) v1(27.7,94.76) v1(27.7,93.96) v1(27.7,90.82) v1(27.7,90.02) v1(27.96,83.46) v1(27.96,82.66) v1(31.62,89.53) v1(31.88,54.99) v1(31.88,52.7) v1(32.89,56.77) v1(33.13,69.87) v1(33.13,69.07) v1(33.13,19.2) v1(33.13,18.4) v1(33.4,90.81) v1(33.38,62.76) v1(33.38,61.96) v1(33.53,88.9) v1(33.64,42.31) v1(33.64,41.51) v1(33.93,69.87) v1(33.93,69.07) v1(33.93,19.2) v1(33.93,18.4) v1(34.18,62.76) v1(34.18,61.96) v1(34.44,42.31) v1(34.44,41.51) v1(34.4,10.4) v1(34.4,9.6) v1(35.2,10.4) v1(35.2,9.6) v1(35.92,35.07) v1(35.92,34.27) v1(36.72,35.07) v1(36.72,34.27) v1(36.96,47.62) v1(38.23,48.89) v1(38.46,63.27) v1(38.46,62.47) v1(39.26,63.27) v1(39.26,62.47) v1(39.47,49.98) v1(39.48,14.88) v1(39.48,14.08) v1(40,28.21) v1(40,27.41) v1(40.11,19.7) v1(40.11,18.9) v1(40.28,14.88) v1(40.28,14.08) v1(40.91,19.7) v1(40.91,18.9) v1(42.27,88.54) v1(42.27,87.74) v1(43.07,88.54) v1(43.07,87.74) v1(43.41,59.84) v1(43.41,59.04) v1(43.74,35.47) v1(43.74,34.67) v1(43.81,45.47) v1(43.94,42.93) v1(43.94,40.77) v1(44.22,59.84) v1(44.22,59.04) v1(44.58,10.4) v1(44.58,9.6) v1(45.09,78.99) v1(45.38,10.4) v1(45.38,9.6) v1(45.97,41.02) v1(46.06,93.46) v1(46.06,89.61) v1(46.08,56.53) v1(46.08,55.73) v1(46.35,43.05) v1(46.35,38.35) v1(46.35,34.56) v1(46.35,33.76) v1(46.61,27.05) v1(46.88,56.53) v1(46.88,55.73) v1(47.28,27.72) v1(47.5,78.99) v1(48.37,54.25) v1(48.37,53.45) v1(48.64,40.89) v1(48.64,38.35) v1(48.77,35.43) v1(48.9,89.79) v1(49.15,78.99) v1(49.17,54.25) v1(49.17,53.45) v1(49.28,93.22) v1(49.89,89.77) v1(50.29,31.13) v1(50.29,30.33) v1(50.42,94.11) v1(50.55,78.99) v1(50.69,89.77) v1(50.65,51.96) v1(50.65,51.16) v1(51.05,35.69) v1(51.05,33.53) v1(51.16,14.62) v1(51.16,13.82) v1(51.31,38.23) v1(51.44,89.15) v1(51.45,51.96) v1(51.45,51.16) v1(51.94,27.58) v1(51.94,26.78) v1(51.96,14.62) v1(51.96,13.82) v1(52.2,78.99) v1(53.09,31.37) v1(53.19,50.06) v1(53.19,49.26) v1(53.47,33.78) v1(53.72,35.69) v1(53.99,50.06) v1(53.99,49.26) v1(54.36,78.99) v1(54.36,30.23) v1(54.48,27.45) v1(54.48,26.65) v1(54.58,10.4) v1(54.58,9.6) v1(55.38,10.4) v1(55.38,9.6) v1(55.73,48.03) v1(55.73,47.22) v1(55.75,31.62) v1(55.75,28.7) v1(56.13,33.66) v1(56.53,48.03) v1(56.53,47.22) v1(57.15,78.99) v1(57.15,29.97) v1(57.15,27.66) v1(58.27,45.87) v1(58.27,45.07) v1(58.29,31.24) v1(58.29,28.83) v1(59.07,45.87) v1(59.07,45.07) v1(59.51,89.77) v1(59.51,88.97) v1(59.69,30.1) v1(60.31,89.77) v1(60.31,88.97) v1(60.69,43.83) v1(60.69,43.03) v1(61.49,43.83) v1(61.49,43.03) v1(61.58,95.65) v1(61.58,94.85) v1(61.58,15.39) v1(61.58,14.59) v1(62.08,86.89) v1(62.08,86.09) v1(62.38,95.65) v1(62.38,94.85) v1(62.38,15.39) v1(62.38,14.59) v1(62.88,86.89) v1(62.88,86.09) v1(64.58,10.54) v1(64.58,9.74) v1(65.38,10.54) v1(65.38,9.74) v1(66.93,57.4) v1(66.91,35.71) v1(66.91,34.91) v1(67.71,35.71) v1(67.71,34.91) v1(68.58,65.79) v1(69.07,18.81) v1(69.07,18.01) v1(69.2,91.46) v1(69.2,90.66) v1(69.87,18.81) v1(69.87,18.01) v1(70,91.46) v1(70,90.66) v1(69.96,86.12) v1(69.96,85.33) v1(70.47,96.16) v1(70.47,95.36) v1(70.76,86.12) v1(70.76,85.33) v1(71.27,96.16) v1(71.27,95.36) v1(71.35,15.77) v1(71.35,14.97) v1(71.5,68.07) v1(71.48,31.26) v1(71.48,30.46) v1(71.74,7.13) v1(71.74,6.33) v1(71.88,65.28) v1(72.14,57.53) v1(72.14,47.24) v1(72.14,42.42) v1(72.16,15.77) v1(72.16,14.97) v1(72.28,31.26) v1(72.28,30.46) v1(72.54,7.13) v1(72.54,6.33) v1(73.28,51.31) v1(73.66,60.83) v1(73.79,37.59) v1(75.69,46.23) v1(76.2,53.21) v1(76.2,40.77) v1(77.2,94.76) v1(77.2,93.96) v1(77.2,5.73) v1(77.2,4.93) v1(78,94.76) v1(78,93.96) v1(78,5.73) v1(78,4.93) v1(79.88,42.55) v1(80.26,70.61) v1(80.9,67.82) v1(81.53,65.28) v1(81.72,49.98) v1(82.17,47.5) v1(82.3,39.62) v1(82.4,77.87) v1(82.4,77.07) v1(82.55,34.67) v1(82.93,70.23) v1(83.2,77.87) v1(83.2,77.07) v1(83.31,60.07) v1(83.44,57.4) v1(83.82,44.83) v1(84.07,52.32) v1(84.31,20.72) v1(84.31,19.92) v1(84.46,67.94) v1(84.58,62.48) v1(84.96,55.12) v1(85.11,20.72) v1(85.11,19.92) v1(85.22,32) v1(85.58,82.44) v1(85.58,81.64) v1(85.83,27.45) v1(85.83,26.65) v1(86.38,82.44) v1(86.38,81.64) v1(86.63,27.45) v1(86.63,26.65) v1(86.87,57.15) v1(86.87,39.88) v1(87.17,49.98) v1(87.38,65.28) v1(87.38,47.12) v1(87.88,70.36) v1(88.63,74.19) v1(88.63,73.39) v1(89.15,59.69) v1(89.15,32) v1(89.43,74.19) v1(89.43,73.39) v1(89.64,84.47) v1(89.64,83.67) v1(89.92,62.48) v1(89.92,42.29) v1(90.3,37.08) v1(90.44,84.47) v1(90.44,83.67) v1(90.68,45.08) v1(90.79,79.9) v1(90.79,79.1) v1(91.44,70.36) v1(91.59,79.9) v1(91.59,79.1) v1(92.2,55.5) v1(92.46,52.83) v1(92.78,49.98) v1(92.96,39.62) v1(94.22,13.1) v1(94.22,12.3) v1(95.01,13.1) v1(95.01,12.3)
VCC: length 209.3
  Top Layer w0.254: 82.53,14.5 74.05,22.98 74.05,13.47 68.2,7.62 61.99,7.62 ; 82.53,14.5 启动.2 87.53,14.5 96,22.97 U1.1 ; 82.53,14.5 80.85,12.82 R26.2 ; 蜂鸣器.1 10.71,86.49 28.72,86.49 Q3.2 30.48,85.71 ; R16.1 52,7.63 52.01,7.62 ; 30.48,85.71 30.48,84.51 v1(29.21,83.24) ; 30.48,85.71 30.48,89.45 ; v1(29.21,76.33) 29.21,27.18 30.87,25.52 30.87,10.38 R14.1 33.63,7.62 41.99,7.62 ; 52.01,7.62 41.99,7.62 ; 52.01,7.62 61.99,7.62 ; 30.48,89.45 30.48,93.2 Q1.2 ; 30.48,89.45 Q2.2 ; 41.99,7.62 42,7.63 R15.1 ; 61.99,7.62 62,7.63 R17.1
  Bottom Layer w0.254: v1(29.21,83.24) v1(29.21,76.33)
A: length 13.8
  Bottom Layer w0.254: v1(45.18,83.13) 44.96,83.36 44.96,95.12 七段式数码管.11
B: length 25
  Top Layer w0.254: 七段式数码管.7 56.35,97.19 55.63,97.92 v1(47.62,97.92)
  Bottom Layer w0.254: v1(46.71,83.13) 47.62,84.05 v1(47.62,97.92)
BUTTON1: length 39.7
  Top Layer w0.254: 58.81,25.52 58.04,24.75 58.04,24 57.66,23.62 57.66,20.83 54.23,17.4 38.4,17.4 Button1.1 ; Button1.1 38,11 C1.1 ; Button1.1 32,11 R14.2
BUTTON2: length 31.7
  Top Layer w0.254: C2.1 48,11 Button2.1 ; R15.2 45,13.75 Button2.1 ; Button2.1 47.13,16.13 54.61,16.13 60.07,21.59 60.07,23.88 61.35,25.16 61.35,25.52
BUTTON3: length 24.2
  Top Layer w0.254: R16.2 55,13.75 Button3.1 ; C3.1 58,11 Button3.1 ; Button3.1 62.38,21.38 62.38,23.26 63.89,24.77 63.89,25.52
BUTTON4: length 21.2
  Top Layer w0.254: R17.2 65,13.75 Button4.1 ; Button4.1 64.92,14.08 64.92,23.52 66.43,25.03 66.43,25.52 ; Button4.1 68,11 C4.1
C: length 5.8
  Top Layer w0.254: 七段式数码管.4 51.27,85.43 50.99,85.15 48.45,85.15 v1(48.26,84.96)
  Bottom Layer w0.254: v1(48.26,84.96) 48.23,84.94 v1(48.23,83.13)
D: length 10.4
  Top Layer w0.254: v1(49.91,88.14) 46.74,88.14 46.19,87.59 七段式数码管.2
  Bottom Layer w0.254: v1(49.91,88.14) 49.91,83.29 v1(49.76,83.13)
DIG1: length 15.1
  Top Layer w0.254: 七段式数码管.12 39.33,92.03 35.1,92.03 Q1.3
DIG1_CONTROL: length 90.2
  Bottom Layer w0.254: 58.81,22.98 57.3,24.49 57.3,25.95 21.72,61.53 21.72,92.57 v1(25.41,96.27)
DIG2: length 21.5
  Top Layer w0.254: 七段式数码管.9 46.59,91.67 Q2.3
DIG2_CONTROL: length 87
  Bottom Layer w0.254: v1(25.54,92.58) 22.48,89.53 22.48,63.31 59.84,25.95 59.84,24.49 61.35,22.98
DIG3: length 25.6
  Top Layer w0.254: 七段式数码管.8 48.78,91.32 35.1,91.32 Q3.3
DIG3_CONTROL: length 83.6
  Bottom Layer w0.254: v1(25.54,88.77) 23.24,86.48 23.24,65.08 62.38,25.95 62.38,24.49 63.89,22.98
DIG4: length 30.6
  Top Layer w0.254: Q4.3 31.71,86.19 36.48,90.96 51.58,90.96 七段式数码管.6
DIG4_CONTROL: length 80.3
  Bottom Layer w0.254: 66.43,22.98 64.92,24.49 64.92,25.95 24,66.86 24,83.56 v1(25.54,85.09)
DP: length 11.2
  Top Layer w0.254: v1(53.85,87.5) 50.04,87.5 七段式数码管.3
  Bottom Layer w0.254: v1(55.85,83.13) 55.85,83.72 55.12,84.45 55.12,86.74 54.36,87.5 v1(53.85,87.5)
E: length 10.4
  Top Layer w0.254: 七段式数码管.1 43.65,84.75 44.2,84.2 v1(51.28,84.2)
  Bottom Layer w0.254: v1(51.28,83.13) v1(51.28,84.2)
F: length 18.7
  Top Layer w0.254: 七段式数码管.10 48.73,96.86 49.28,97.41 52.2,97.41 v1(52.58,97.03)
  Bottom Layer w0.254: v1(52.8,83.13) 52.58,83.36 v1(52.58,97.03)
G: length 3.3
  Bottom Layer w0.254: 七段式数码管.5 54.33,85.67 v1(54.33,83.13)
IO_81: length 24.2
  Bottom Layer w0.254: 74.05,74.48 79.48,69.05 U1.18
IO_83: length 27.8
  Bottom Layer w0.254: 71.51,74.48 79.48,66.51 U1.17
IO_85: length 31.4
  Bottom Layer w0.254: 68.97,74.48 79.48,63.97 U1.16
IO_87: length 35
  Bottom Layer w0.254: U1.15 79.48,61.43 66.43,74.48
IO_90: length 38.6
  Bottom Layer w0.254: U1.14 79.48,58.89 63.89,74.48
IO_97: length 42.2
  Bottom Layer w0.254: 61.35,74.48 79.48,56.35 U1.13
IO_116: length 45.8
  Bottom Layer w0.254: 58.81,74.48 79.48,53.81 U1.12
IO_118: length 49.3
  Bottom Layer w0.254: 56.27,74.48 79.48,51.27 U1.11
IO_120: length 52.9
  Bottom Layer w0.254: U1.10 79.48,48.73 53.73,74.48
IO_122: length 56.6
  Bottom Layer w0.254: 51.19,74.48 52.58,73.09 52.58,73.03 79.41,46.19 U1.9
IO_124: length 60.1
  Bottom Layer w0.254: U1.8 79.48,43.65 48.65,74.48
IO_128: length 63.7
  Bottom Layer w0.254: 46.11,74.48 79.48,41.11 U1.7
IO_130: length 67.3
  Bottom Layer w0.254: 43.57,74.48 79.48,38.57 U1.6
IO_132: length 70.9
  Bottom Layer w0.254: U1.5 79.48,36.03 41.03,74.48
IO_134: length 74.5
  Bottom Layer w0.254: U1.4 79.48,33.49 38.49,74.48
IO_136: length 78.1
  Bottom Layer w0.254: 35.95,74.48 79.48,30.95 U1.3
LED1: length 12.4
  Top Layer w0.254: R18.2 70.03,80.9 66.81,80.9 63.89,77.98 63.89,77.02
LED2: length 12.4
  Top Layer w0.254: R19.2 72.72,80.54 69.95,80.54 66.43,77.02
LED3: length 12.9
  Top Layer w0.254: 68.97,77.02 72.14,80.19 75.42,80.19 R20.2
LED4: length 13.4
  Top Layer w0.254: 71.51,77.02 74.32,79.83 78.11,79.83 R21.2
URXD: length 81.6
  Top Layer w0.254: U1.20 93.82,71.95 65.6,71.95 62.23,68.58 62.23,31.48 56.27,25.52
UTXD: length 82.6
  Top Layer w0.254: 56.27,22.98 56.77,23.48 56.77,24.13 57.4,24.76 57.4,25.78 62.87,31.24 62.87,68.33 65.88,71.34 95.75,71.34 U1.19
$1N2952: length 2.3
  Top Layer w0.254: R1.1 29.11,96.27 Q1.1
$1N2997: length 2.2
  Top Layer w0.254: Q2.1 29.17,92.58 R2.2
$1N3042: length 2.2
  Top Layer w0.254: Q3.1 29.1,88.77 R3.2
$1N3087: length 2.2
  Top Layer w0.254: R4.2 29.16,85.09 Q4.1
$1N3645: length 62.5
  Top Layer w0.254: 35.95,22.98 37.46,24.49 37.46,26.54 42.54,31.62 42.54,77.45 45.18,80.09 R6.2
$1N3690: length 62.1
  Top Layer w0.254: R7.2 46.71,79.07 45.08,77.45 45.08,31.49 40,26.41 40,24.49 38.49,22.98
$1N3862: length 61.6
  Top Layer w0.254: 41.03,22.98 42.54,24.49 42.54,26.67 47.62,31.75 47.62,77.47 48.23,78.08 R8.2
$1N3907: length 61.3
  Top Layer w0.254: R9.2 49.76,31.72 45.08,27.05 45.08,24.25 43.81,22.98 43.57,22.98
$1N3952: length 61.6
  Top Layer w0.254: 46.11,22.98 47.62,24.49 47.62,26.79 52.22,31.39 52.22,77.45 51.28,78.39 R10.2
$1N3997: length 62
  Top Layer w0.254: 48.65,22.98 50.16,24.49 50.16,26.92 54.76,31.52 54.76,77.45 52.8,79.4 R11.2
$1N4042: length 62.4
  Top Layer w0.254: R12.2 54.33,80.61 57.3,77.63 57.3,31.39 52.7,26.79 52.7,24.89 51.19,23.38 51.19,22.98
$1N4087: length 62.8
  Top Layer w0.254: 53.73,22.98 55.24,24.49 55.24,26.92 59.84,31.52 59.84,77.45 55.85,81.43 R13.2
$1N5868: length 2.5
  Top Layer w0.254: LED1.1 72.94,85.31
$1N5907: length 2.5
  Top Layer w0.254: LED2.1 75.98,85.31
$1N5946: length 2.5
  Top Layer w0.254: LED3.1 79.03,85.31
$1N5985: length 2.5
  Top Layer w0.254: LED4.1 82.08,85.31
$1N6404: length 5
  Top Layer w0.254: 启动.1 88,8.5 R23.2
$1N6621: length 4
  Top Layer w0.254: 19.97,89.35 19.97,87.52 R24.1 ; 19.97,89.35 Q5.1 ; 19.97,89.35 R25.1
$1N6622: length 3.7
  Top Layer w0.254: Q5.3 15.54,90.17 蜂鸣器.2
$1N6767: length 19.5
  Top Layer w0.254: R24.2 22.46,85.49 29.08,78.87 34.1,78.87 35.95,77.02
$1N7687: length 2
  Top Layer w0.254: 供电指示.1 80.28,9.32 R26.1

## Copper pours and planes (outline as drawn; the poured copper is in the pictures)
GND on Top Layer: 0,100 100,100 100,0 0,0
GND on Bottom Layer: 0,100 100,100 100,0 0,0

Small or netless copper shapes (teardrops, artwork), in the pictures only: 123 on Top Layer, 45 on Bottom Layer

## Text on the board
Top Silkscreen Layer: IO_14 | IO_10 | IO_12 | IO_13 | IO_15 | URXD | UTXD | IO_11 | IO_4 | IO_0 | IO_2 | IO_3 | IO_5 | IO_7 | IO_8 | IO_6 | IO_9 | IO_1 | VCC | GND | 2024.07.16 | 刘鼎琨 / 柯昀志 / 李逸帆 | 武汉大学计算机学院
